# EAGLE board Inverter (EAGLE 9.6.2)
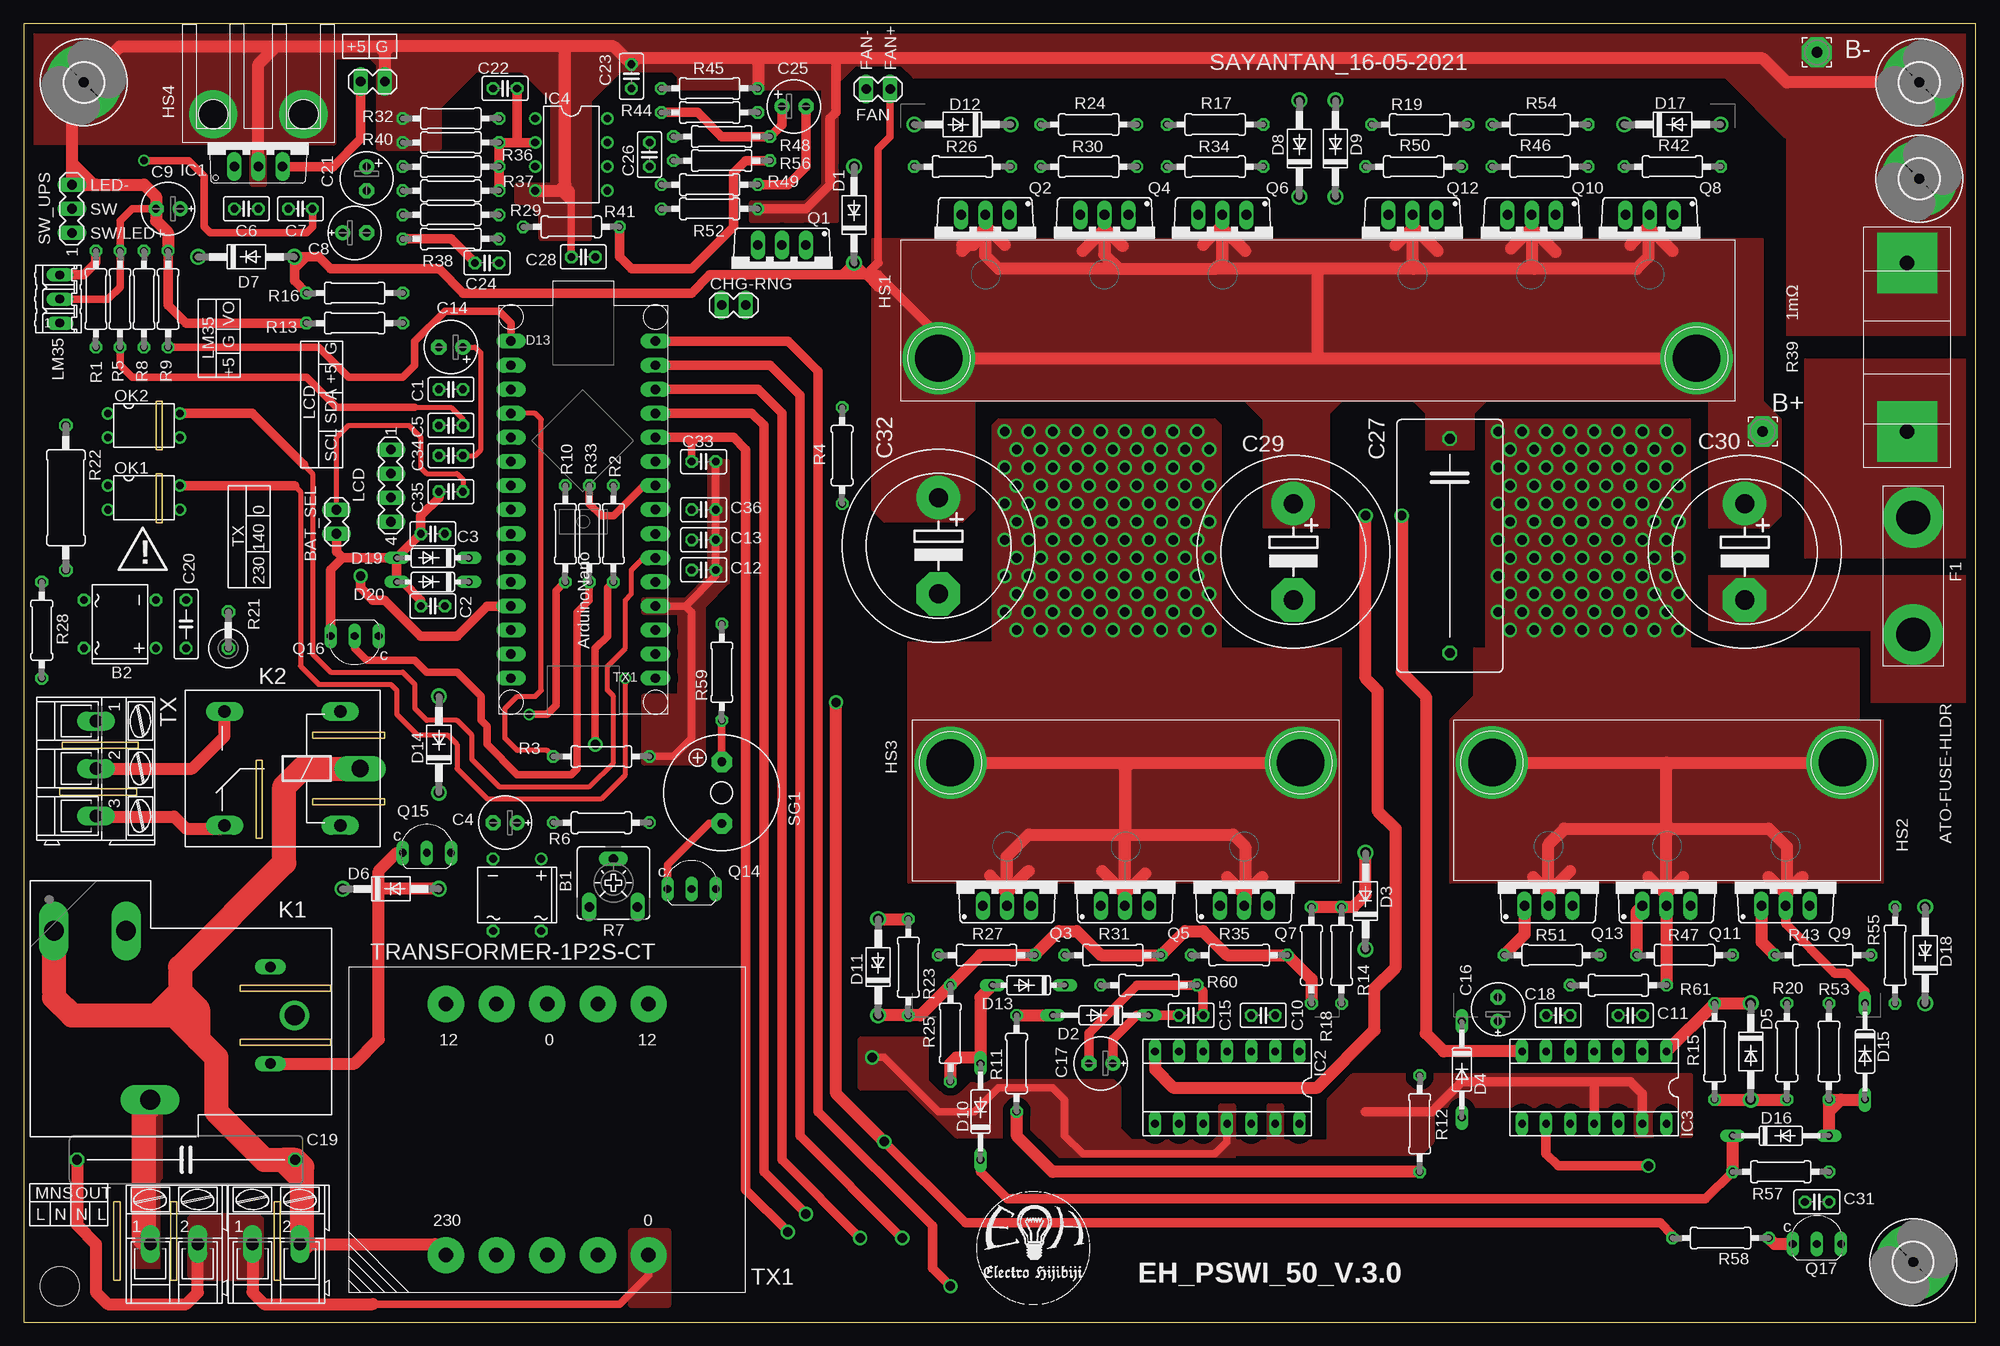
[diagram p1: board, top side]
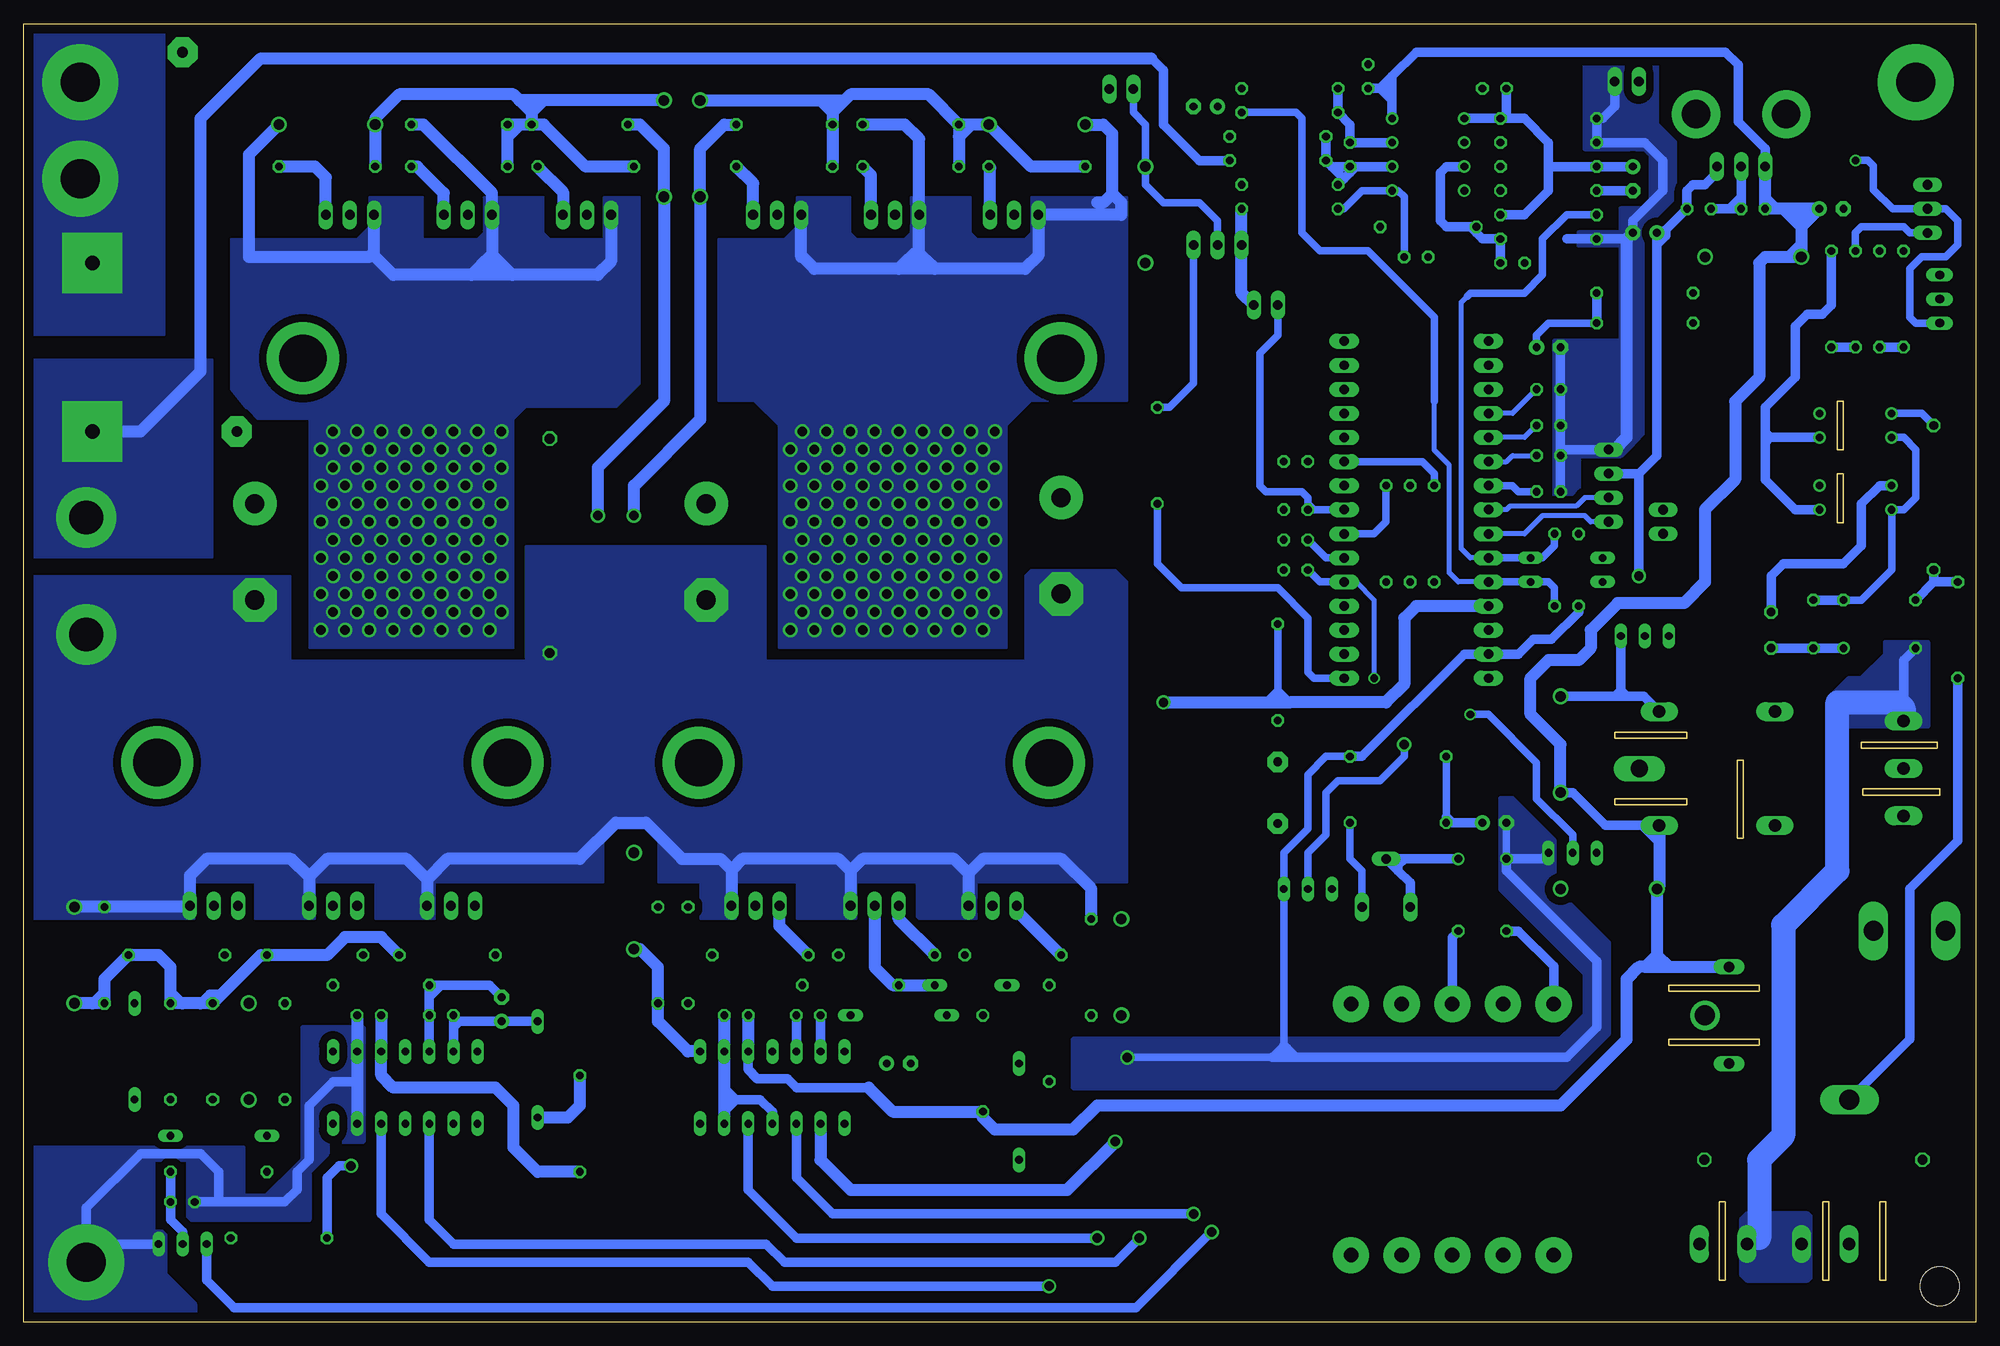
[diagram p2: board, bottom side, seen from below]

Size 206 x 137 mm. Coordinates in mm from the lower left corner, seen from the top.
Outline: 0,0 206,0 206,137 0,137 0,0
Outline: 14.61,97.16 14.61,92.08 13.97,92.08 13.97,97.16 14.61,97.16
Outline: 13.97,89.53 14.61,89.53 14.61,84.33 13.97,84.33 13.97,89.53
Outline: 9.53,12.7 9.53,4.45 10.16,4.45 10.16,12.7 9.53,12.7
Outline: 15.49,12.7 15.49,4.45 16.13,4.45 16.13,12.7 15.49,12.7
Outline: 26.42,12.7 26.42,4.45 27.05,4.45 27.05,12.7 26.42,12.7
Outline: 22.86,35.56 32.38,35.56 32.38,34.92 22.86,34.92 22.86,35.56
Outline: 22.86,29.84 32.38,29.84 32.38,29.21 22.86,29.21 22.86,29.84
Outline: 30.48,62.23 38.1,62.23 38.1,61.59 30.48,61.59 30.48,62.23
Outline: 30.48,55.24 38.1,55.24 38.1,54.61 30.48,54.61 30.48,55.24
Outline: 24.51,59.31 24.51,51.05 25.15,51.05 25.15,59.31 24.51,59.31
Outline: 4.06,61.21 12.06,61.21 12.06,60.58 4.06,60.58 4.06,61.21
Outline: 3.81,56.26 11.94,56.26 11.94,55.63 3.81,55.63 3.81,56.26
Copper layers (1*16): Top 0.035mm / dielectric 1.5mm / Bottom 0.035mm
Design rules "default *": minimum track width 20mil, minimum drill 0.8mm, track to track 20mil, track to pad 20mil, pad to pad 6mil, via to via 20mil, smd to smd 6mil, copper to edge 40mil, drill to drill 6mil, minimum pad ring 10mil, minimum via ring 8mil, stop-mask expansion 4mil, vias tented up to drill 0mil, thermal gap 10mil
Holes 4.11 mm at 3.81,3.81

## Footprints (pad centres in the part's own frame; a part is rotated, then mirrored left to right if it is on the bottom)
MA02-1 = drill 1.016 long: 1 -1.27,0; 2 1.27,0
ARDUINONANO-MINIMUM-TXT = drill 1 pad 1.575 long: 1 -7.62,16.51; 2 -7.62,13.97; 3 -7.62,11.43; 4 -7.62,8.89; 5 -7.62,6.35; 6 -7.62,3.81; 7 -7.62,1.27; 8 -7.62,-1.27; 9 -7.62,-3.81; 10 -7.62,-6.35; 11 -7.62,-8.89; 12 -7.62,-11.43; 13 -7.62,-13.97; 14 -7.62,-16.51; 15 -7.62,-19.05; 16 7.62,-19.05; 17 7.62,-16.51; 18 7.62,-13.97; 19 7.62,-11.43; 20 7.62,-8.89; 21 7.62,-6.35; 22 7.62,-3.81; 23 7.62,-1.27; 24 7.62,1.27; 25 7.62,3.81; 26 7.62,6.35; 27 7.62,8.89; 28 7.62,11.43; 29 7.62,13.97; 30 7.62,16.51
DB = drill 0.813: + -2.54,-3.81 | drill 0.813 octagon: - 2.54,-3.81; AC1 2.54,3.81; AC2 -2.54,3.81
3,17/1,1 = drill 1.118 pad 3.175 octagon: 1 0,0
C025-025X050 = drill 0.813 octagon: 1 -1.27,0; 2 1.27,0
E2,5-6E = drill 0.813 pad 1.575: + -1.27,0 | drill 0.813 pad 1.575 octagon: - 1.27,0
E2,5-6 = drill 0.813 pad 1.6: + -1.27,0 | drill 0.813 pad 1.6 octagon: - 1.27,0
C230-85X245 = drill 1.016 octagon: 1 -11.506,0; 2 11.506,0
C050-025X075 = drill 0.813 octagon: 1 -2.54,0; 2 2.54,0
C225-113X268 = drill 1.016 octagon: 1 -11.303,0; 2 11.303,0
EB20D = drill 2.007 pad 4.597: + -5.08,0 | drill 2.007 pad 4.597 octagon: - 5.08,0
DO41-10 = drill 1.118: A 5.08,0; C -5.08,0
DO35-10 = drill 0.813 long: A 5.08,0; C -5.08,0
DO41Z10 = drill 1.118: A 5.08,0; C -5.08,0
DO35-7 = drill 0.813 long: A 3.81,0; C -3.81,0
ATO-FUSE-HOLDER = drill 3.556 pad 6.35: P$1 -6.172,0; P$2 6.172,0
4,1-PAD = drill 4.1 pad 8: B4,1 0,0
MK-46-88MM = drill 5.004 pad 7.62: 1 -39.98,-3.988; 2 39.98,-3.988
MK-46-45MM = drill 5.004 pad 7.62: 1 -18.491,-3.988; 2 18.491,-3.988
PI49-20MM = drill 2.997 pad 5.08: 1 -4.75,2.997; 2 4.75,2.997
TO220V = drill 1.016 long: 1 -2.54,-2.54; 2 0,-2.54; 3 2.54,-2.54
SOCKET-14 = drill 0.813 long: 1 -7.62,-3.81; 2 -5.08,-3.81; 3 -2.54,-3.81; 4 0,-3.81; 5 2.54,-3.81; 6 5.08,-3.81; 7 7.62,-3.81; 8 7.62,3.81; 9 5.08,3.81; 10 2.54,3.81; 11 0,3.81; 12 -2.54,3.81; 13 -5.08,3.81; 14 -7.62,3.81
DIL08 = drill 0.813 pad 1.27: 1 -3.81,-3.81; 2 -1.27,-3.81; 3 1.27,-3.81; 4 3.81,-3.81; 5 3.81,3.81; 6 1.27,3.81; 7 -1.27,3.81; 8 -3.81,3.81
T90-C = drill 2.1 long: 1 -8.9,12.7; 5 8.9,15.24; 6 8.9,22.84 | drill 1.1 long: 2 -5.1,0; 4 5.1,0 | drill 2.1 pad 2.54: 3 0,-2.54
ZF112 = drill 1.321 long: 1 -6.096,5.994; 2 -6.096,-5.994; O 6.096,5.994; S 6.096,-5.994 | drill 1.803 long: P -8.204,0
MA04-1 = drill 1.016 long: 1 -3.81,0; 2 -1.27,0; 3 1.27,0; 4 3.81,0
03P = drill 0.914 long: 1 -2.54,0; 2 0,0; 3 2.54,0
AK300/2 = drill 1.321 long: 1 -2.515,0; 2 2.489,0
DIP4 = drill 0.8: 1 -1.27,-3.81; 2 1.27,-3.81; 3 1.27,3.81; 4 -1.27,3.81
TO220BV = drill 1.016 long: D 0,-2.54; G -2.54,-2.54; S 2.54,-2.54
TO92_LIN = drill 0.813 pad 1.143 long: 1 2.54,0; 2 0,0; 3 -2.54,0
0207/10 = drill 0.813 octagon: 1 -5.08,0; 2 5.08,0
CA6V = drill 1.016 long: A -2.54,-2.54; E 2.54,-2.54; S 0,2.54
0411V = drill 0.914 octagon: 1 -2.54,0; 2 1.27,0
0411/15 = drill 0.914 octagon: 1 -7.62,0; 2 7.62,0
SHUNT-R = drill 1.524 pad 6.35 square: P$1 -8.89,0; P$2 8.89,0
F/QMX = drill 0.914 pad 2.159 octagon: + 3.251,0; - -3.251,0
MA03-1 = drill 1.016 long: 1 -2.54,0; 2 0,0; 3 2.54,0
AK300/3 = drill 1.321 long: 1 -5.004,0; 2 0,0; 3 5.004,0
XFMR-1S2P-CT-41X34MM = drill 1.524 pad 3.81: 1 31.648,30.378; 2 26.302,30.378; 3 20.955,30.378; 4 15.608,30.378; 5 10.262,30.378; 6 10.262,3.886; 7 15.608,3.886; 8 20.955,3.886; 9 26.302,3.886; 10 31.648,3.886

## Placement (x,y rotation side)
5V  [MA02-1]  36.83,130.89 0 top
A1  [ARDUINONANO-MINIMUM-TXT]  59.05,84.45 180 top
B1  DBDB107G  [DB]  52.07,45.09 180 top
B2  DBDB107G  [DB]  10.16,73.66 90 top
B+  [3,17/1,1]  183.51,93.98 0 top
B-  [3,17/1,1]  189.23,133.99 0 top
BAT_SEL  [MA02-1]  33.02,84.45 270 top
C1  0.1u  [C025-025X050]  45.09,98.42 180 top
C2  0.1u  [C025-025X050]  43.18,75.56 180 top
C3  0.1u  [C025-025X050]  43.18,83.19 180 top
C4  10u  [E2,5-6E]  50.8,52.7 180 top
C5  0.1u  [C025-025X050]  45.09,94.61 180 top
C6  0.1u  [C025-025X050]  23.5,117.47 0 top
C7  0.1u  [C025-025X050]  29.21,117.47 180 top
C8  47u  [E2,5-6E]  34.92,114.94 0 top
C9  220u  [E2,5-6E]  15.24,117.47 180 top
C10  0.1u  [C025-025X050]  130.81,32.38 0 top
C11  0.1u  [C025-025X050]  169.54,32.38 0 top
C12  0.1u  [C025-025X050]  71.75,79.38 0 top
C13  0.1u  [C025-025X050]  71.75,82.55 0 top
C14  2.2u  [E2,5-6]  45.09,102.87 180 top
C15  0.1u  [C025-025X050]  123.19,32.38 0 top
C16  10u  [E2,5-6E]  155.57,33.02 90 top
C17  10u  [E2,5-6E]  113.67,27.3 180 top
C18  0.1u  [C025-025X050]  161.93,32.38 0 top
C19  2.2u  [C230-85X245]  17.14,17.14 180 top
C20  0.033u  [C050-025X075]  17.14,73.66 90 top
C21  4.7u  [E2,5-6]  36.2,120.65 270 top
C22  0.1u  [C025-025X050]  50.8,130.18 0 top
C23  0.1u  [C025-025X050]  64.14,131.44 90 top
C24  0.1u  [C025-025X050]  48.9,111.76 180 top
C25  0.47u  [E2,5-6]  81.28,128.27 0 top
C26  0.1u  [C025-025X050]  66.04,123.19 270 top
C27  1u  [C225-113X268]  150.5,81.92 270 top
C28  0.1u  [C025-025X050]  59.05,112.39 180 top
C29  4700u  [EB20D]  133.99,81.28 270 top
C30  4700u  [EB20D]  181.61,81.28 270 top
C31  0.01u  [C025-025X050]  189.23,12.7 180 top
C32  4700u  [EB20D]  96.52,81.92 270 top
C33  0.1u  [C025-025X050]  71.75,90.81 0 top
C34  0.1u  [C025-025X050]  45.09,91.44 180 top
C35  0.1u  [C025-025X050]  45.09,87.63 180 top
C36  0.1u  [C025-025X050]  71.75,85.72 0 top
CHG-RNG  [MA02-1]  74.93,107.31 0 top
D1  1N4004  [DO41-10]  87.63,116.84 90 top
D2  1N4148DO35-10  [DO35-10]  113.67,32.38 180 top
D3  MBR160  [DO41-10]  141.6,44.45 90 top
D4  1N4148DO35-10  [DO35-10]  151.76,26.67 270 top
D5  MBR160  [DO41-10]  182.25,28.57 270 top
D6  1N4004  [DO41-10]  38.73,45.72 0 top
D7  1N4004  [DO41-10]  23.5,112.39 0 top
D8  MBR160  [DO41-10]  134.62,123.83 90 top
D9  MBR160  [DO41-10]  138.43,123.83 90 top
D10  1N4148DO35-10  [DO35-10]  100.97,22.23 90 top
D11  1N4744A  [DO41Z10]  90.17,37.47 90 top
D12  1N4744A  [DO41Z10]  99.06,126.36 180 top
D13  1N4148DO35-7  [DO35-7]  106.05,35.56 180 top
D14  1N4004  [DO41-10]  43.81,60.96 90 top
D15  1N4148DO35-10  [DO35-10]  194.31,28.57 270 top
D16  1N4148DO35-10  [DO35-10]  185.42,19.68 0 top
D17  1N4744A  [DO41Z10]  173.99,126.36 0 top
D18  1N4744A  [DO41Z10]  200.66,38.73 90 top
D19  C5V1-7MM  [DO35-7]  43.18,80.64 180 top
D20  C5V1-7MM  [DO35-7]  43.18,78.11 180 top
F1  ATO-FUSE-HLDR  [ATO-FUSE-HOLDER]  199.39,78.74 270 top
FAN  [MA02-1]  90.17,130.1 180 top
H1  MOUNT-PAD-ROUND4.1  [4,1-PAD]  200.03,120.65 0 top
H2  MOUNT-PAD-ROUND4.1  [4,1-PAD]  6.35,130.81 0 top
H3  MOUNT-PAD-ROUND4.1  [4,1-PAD]  200.03,130.81 0 top
H4  MOUNT-PAD-ROUND4.1  [4,1-PAD]  199.39,6.35 0 top
HS1  MK-46-88MM  [MK-46-88MM]  136.55,105.69 0 top
HS2  MK-46-45MM  [MK-46-45MM]  173.43,55.07 180 top
HS3  MK-46-45MM  [MK-46-45MM]  116.28,55.04 180 top
HS4  HS-PI49  [PI49-20MM]  24.77,124.46 0 top
IC1  7805TV  [TO220V]  24.77,124.46 0 top
IC2  FAN9732  [SOCKET-14]  127,24.77 180 top
IC3  FAN9732  [SOCKET-14]  165.74,24.77 180 top
IC4  LM358N  [DIL08]  57.78,123.19 270 top
K1  HRG90-C  [T90-C]  26.04,32.38 90 top
K2  ZF112  [ZF112]  27.3,58.42 180 top
LCD  [MA04-1]  38.73,88.27 270 top
LM35  [03P]  3.81,107.95 90 top
MNS  [AK300/2]  15.88,8.26 0 top
OK1  SFH618A-2  [DIP4]  12.7,87 270 top
OK2  SFH618A-2  [DIP4]  12.7,94.61 270 top
OUT  [AK300/2]  26.67,8.26 0 top
Q1  Z44  [TO220BV]  80.01,111.12 180 top
Q2  Z44  [TO220BV]  101.47,114.3 180 top
Q3  Z44  [TO220BV]  103.76,46.48 0 top
Q4  Z44  [TO220BV]  114.05,114.3 180 top
Q5  Z44  [TO220BV]  116.2,46.48 0 top
Q6  Z44  [TO220BV]  126.49,114.3 180 top
Q7  Z44  [TO220BV]  128.78,46.48 0 top
Q8  Z44  [TO220BV]  171.58,114.3 180 top
Q9  Z44  [TO220BV]  185.93,46.48 0 top
Q10  Z44  [TO220BV]  159.13,114.3 180 top
Q11  Z44  [TO220BV]  173.35,46.48 0 top
Q12  Z44  [TO220BV]  146.56,114.3 180 top
Q13  Z44  [TO220BV]  160.91,46.48 0 top
Q14  BC547  [TO92_LIN]  70.48,45.72 0 top
Q15  BC547  [TO92_LIN]  42.55,49.53 0 top
Q16  BC547  [TO92_LIN]  34.92,72.39 180 top
Q17  BC547  [TO92_LIN]  189.23,8.26 0 top
R1  1k  [0207/10]  7.62,107.95 270 top
R2  1k  [0207/10]  62.23,83.19 270 top
R3  4.7k  [0207/10]  60.96,59.69 180 top
R4  560  [0207/10]  86.36,91.44 270 top
R5  10k  [0207/10]  10.16,107.95 90 top
R6  10k  [0207/10]  60.96,52.7 0 top
R7  5k  [CA6V]  62.23,46.35 0 top
R8  100  [0207/10]  12.7,107.95 90 top
R9  10k  [0207/10]  15.24,107.95 270 top
R10  560  [0207/10]  57.15,83.19 270 top
R11  10  [0207/10]  104.78,27.3 90 top
R12  10  [0207/10]  147.32,20.95 90 top
R13  22k  [0207/10]  34.92,105.41 0 top
R14  47  [0207/10]  139.06,38.73 90 top
R15  47  [0207/10]  178.44,28.57 270 top
R16  47k  [0207/10]  34.92,108.58 180 top
R17  47  [0207/10]  125.73,126.36 180 top
R18  10  [0207/10]  135.89,38.73 270 top
R19  47  [0207/10]  147.32,126.36 0 top
R20  10  [0207/10]  186.06,28.57 90 top
R21  100k  [0411V]  21.59,73.66 90 top
R22  100k  [0411/15]  4.45,87 270 top
R23  47k  [0207/10]  93.34,37.47 270 top
R24  47k  [0207/10]  112.39,126.36 180 top
R25  10k  [0207/10]  97.79,30.48 270 top
R26  4.7  [0207/10]  99.06,121.92 0 top
R27  4.7  [0207/10]  101.6,38.73 180 top
R28  220  [0207/10]  1.91,73.03 270 top
R29  1k  [0207/10]  45.09,116.84 0 top
R30  4.7  [0207/10]  112.39,121.92 0 top
R31  4.7  [0207/10]  114.94,38.73 180 top
R32  4.7k  [0207/10]  45.09,127 0 top
R33  560  [0207/10]  59.69,83.19 270 top
R34  4.7  [0207/10]  125.73,121.92 0 top
R35  4.7  [0207/10]  128.27,38.73 180 top
R36  120k  [0207/10]  45.09,121.92 0 top
R37  1k  [0207/10]  45.09,119.38 0 top
R38  120k  [0207/10]  45.09,114.3 0 top
R39  1mOhm  [SHUNT-R]  198.75,102.87 270 top
R40  2.2k  [0207/10]  45.09,124.46 0 top
R41  2.2k  [0207/10]  57.78,115.57 0 top
R42  4.7  [0207/10]  173.99,121.92 180 top
R43  4.7  [0207/10]  189.87,38.73 0 top
R44  1k  [0207/10]  72.39,127.64 180 top
R45  4.7k  [0207/10]  72.39,130.18 180 top
R46  4.7  [0207/10]  160.02,121.92 180 top
R47  4.7  [0207/10]  175.26,38.73 0 top
R48  220k  [0207/10]  73.66,125.09 180 top
R49  1k  [0207/10]  72.39,120.02 180 top
R50  4.7  [0207/10]  146.69,121.92 180 top
R51  4.7  [0207/10]  161.29,38.73 0 top
R52  2.2k  [0207/10]  72.39,117.47 180 top
R53  10k  [0207/10]  190.5,28.57 270 top
R54  47k  [0207/10]  160.02,126.36 180 top
R55  47k  [0207/10]  197.49,38.73 270 top
R56  2.2k  [0207/10]  73.66,122.56 0 top
R57  10k  [0207/10]  185.42,15.88 0 top
R58  4.7k  [0207/10]  179.07,8.89 180 top
R59  47  [0207/10]  73.66,68.58 90 top
R60  10  [0207/10]  118.75,35.56 180 top
R61  10  [0207/10]  168.28,35.56 180 top
SG1  F/QMX  [F/QMX]  73.66,55.88 90 top
SW_UPS  [MA03-1]  5.08,117.47 90 top
TX  [AK300/3]  7.62,58.42 270 top
TX1  TRANSFORMER-1P2S-CT  [XFMR-1S2P-CT-41X34MM]  76.2,37.47 180 top

## Tracks (layer width: path | path; a pad name or v marks a point on that pad's centre or on a via)
+5V  (via drill 0.8, 1, 1 pad 0.81)
  Top 0.813: C7.1 30.48,115.57 29.84,114.94 19.68,114.94 19.05,115.57 19.05,120.89 17.39,122.55 v12.69,122.55
  Top 1.016: IC3.9 160.66,17.78 161.93,16.51 v171.45,16.51 | R58.2 173.99,9.21 172.72,10.48 99.38,10.48 v90.81,19.05 | A1.27 48.9,75.56 45.72,72.39 41.91,72.39 38.1,76.2 36.83,76.2 35.56,77.47 v35.56,78.74 | IC1.3 32.64,121.92 35.56,124.84 5V.1
  Top 1.27: v90.81,19.05 85.72,24.13 v85.72,65.41
  Bottom 0.813: R59.2 73.66,66.67 | 73.66,66.67 73.66,65.41 | 73.66,66.67 74.93,65.41 | 73.66,66.67 72.39,65.41 | LM35.1 6.35,105.41 6.99,106.05 6.99,111.12 5.71,112.39 3.17,112.39 1.91,113.67 1.91,116.2 3.17,117.47 SW_UPS.2 8.78,117.47 10.81,119.5 10.81,122 11.39,122.58 12.66,122.58 v12.69,122.55
  Bottom 1.016: v171.45,16.51 172.72,16.51 173.99,15.24 R58.2 | IC1.3 27.3,121.28 28.57,120.02 29.84,120.02 30.48,119.38 C7.1 32.7,115.25 | 32.7,115.25 33.02,114.94 C8.+ 33.66,113.67 | 33.66,113.67 33.66,91.44 35.56,89.53 | 35.56,89.53 LCD.2 | 35.56,89.53 v35.56,78.74 | 32.7,115.25 32.7,114.62 33.66,113.67
  Bottom 1.27: IC2.9 121.92,17.14 118.75,13.97 95.89,13.97 v90.81,19.05 | v85.72,65.41 74.93,65.41 73.66,65.41 72.39,65.41 62.23,65.41 60.33,67.31 60.33,74.3 59.05,75.56 A1.27
+VE_CY
  Top 0.508: 29.53,90.49 30.48,89.53 30.48,70.48 32.38,68.58 40.01,68.58 41.27,67.31 41.27,64.77 42.55,63.5 45.72,63.5 47.31,61.91 47.31,59.37 50.16,56.52 59.69,56.52 62.23,59.05 62.23,66.04 61.59,66.67 61.59,69.22 63.5,71.12 63.5,76.2 64.14,76.83 64.14,79.38 65.41,80.64 A1.6
  Top 1.016: OK2.4 24.13,95.89 29.53,90.49
  Bottom 0.813: A1.6 68.58,80.64 C13.1
A4
  Bottom 0.508: LCD.3 41.27,87 42.16,86.11 49.15,86.11 49.53,85.72 A1.23
A5
  Bottom 0.508: LCD.4 40.64,84.45 41.27,85.09 45.72,85.09 47.62,83.19 A1.24
B+
  Top 0.813: FAN.1 91.44,125.09 90.17,123.83 90.17,111.76
  Top 1.016: 86.36,110.49 72.39,110.49 70.48,108.58 46.35,108.58 43.81,111.12 32.38,111.12 31.11,112.39 29.84,112.39 | 86.36,110.49 88.9,110.49 | 88.9,110.49 90.17,110.49 96.57,104.09 HS1.1 | 90.17,111.76 88.9,110.49 | 88.9,110.49 90.17,109.22 | 86.36,110.49 D1.C 88.9,110.49 | 29.84,112.39 D7.A 28.57,111.12 | 28.57,111.12 28.57,109.86 R16.2 | 28.57,111.12 29.84,112.39
  Top 1.27: Q4.D 114.05,112.65 115.57,111.12 | 115.57,111.12 125.73,111.12 | 125.73,111.12 126.49,111.89 Q6.D | 115.57,111.12 102.87,111.12 101.47,112.52 101.47,114.94 | Q12.D 146.56,111.63 146.69,111.12 | 146.69,111.12 136.53,111.12 | 136.53,111.12 125.73,111.12 | 159.38,111.12 159.13,111.38 Q10.D 159.13,115.44 | 159.38,111.12 146.69,111.12 | Q8.D 171.45,116.71 171.45,112.39 170.18,111.12 159.38,111.12 | 101.47,114.94 Q2.D | HS1.1 136.53,101.7 | 136.53,101.7 HS1.2 | 136.53,111.12 136.53,101.7 | 101.47,114.94 100.2,113.67 99.06,113.67 | Q2.D 101.47,115.7 103.5,113.67 | Q2.D 101.47,115.44 99.06,113.03 | Q4.D 114.05,115.32 111.76,113.03 | Q4.D 114.05,115.44 115.95,113.54 | Q6.D 126.49,115.7 124.46,113.67 | Q6.D 126.49,115.44 128.91,113.03 | Q12.D 146.56,115.44 144.78,113.67 | Q12.D 146.56,115.7 149.22,113.03 | 159.13,115.44 156.97,113.28 | 159.13,115.44 161.67,112.9 | Q8.D 171.58,115.7 169.54,113.67 | Q8.D 171.58,115.44 173.99,113.03
  pour Top (isolate 0.813, no thermals): 89.53,114.3 183.51,114.3 183.51,97.16 89.53,97.16
  pour Top (isolate 0.813, no thermals): 89.53,97.16 89.53,85.72 90.81,84.45 99.06,84.45 100.33,85.72 100.33,97.16
  pour Top (isolate 0.813, no thermals): 128.91,97.16 130.81,95.25 130.81,83.82 137.79,83.82 137.79,95.89 139.06,97.16
  pour Top (isolate 0.813, no thermals): 146.69,97.16 147.96,95.89 147.96,92.08 153.03,92.08 153.03,95.89 154.31,97.16
  pour Top (isolate 0.813, no thermals): 177.8,97.16 183.51,97.16 185.42,95.25 185.42,85.09 184.15,83.82 177.8,83.82
BAT_SENS
  Top 0.508: C34.1 47.62,91.44 48.26,92.08 48.26,102.23 47.62,102.87 C14.+
  Bottom 0.508: A1.21 49.53,90.81 48.9,91.44 C34.1
  Bottom 0.813: R13.2 45.09,105.41 46.04,104.46 46.35,104.14 C14.+
  Bottom 1.016: R16.1 R13.2
BUZZ
  Bottom 0.813: A1.7 63.5,83.19 62.23,84.45 R2.1
CHG-RLY
  Top 0.813: A1.9 65.41,88.27 62.23,85.09 60.96,85.09 59.69,86.36 R33.1
CHG-RNG
  Bottom 0.813: 70.48,86.36 C36.1 69.85,85.72 | 70.48,86.36 70.48,87 71.12,87.63 74.93,87.63 75.56,88.27 75.56,102.23 73.66,104.14 CHG-RNG.1 | A1.8 69.85,85.72 | 69.85,85.72 70.48,86.36
CHNG-OVR-RLY
  Bottom 0.813: A1.10 60.96,90.81 58.42,90.81 57.15,89.53 R10.1
FAN
  Bottom 0.813: A1.1 69.85,67.94 70.48,68.58 70.48,74.3 73.66,77.47 83.82,77.47 86.36,80.01 R4.2
FUSE_BLOWN  (via drill 1)
  Top 0.813: C33.1 70.48,92.71 | 70.48,92.71 70.48,93.34 | 70.48,92.71 69.85,93.34 | 70.48,92.71 71.12,93.34 71.75,93.34
  Top 1.016: v80.64,9.53 76.2,13.97 76.2,92.08 74.93,93.34 71.75,93.34 70.48,93.34 69.85,93.34 A1.11
  Top 1.27: Q17.3 184.78,8.26 R58.1
  Bottom 1.016: Q17.3 186.69,4.45 183.77,1.52 88.65,1.52 v80.64,9.53
GND  (via drill 1)
  Top 0.813: 57.15,118.75 56.52,119.38 | C28.2 57.78,118.11 | 57.15,118.75 57.15,120.02 57.78,119.38 57.78,118.11 | 57.15,118.75 57.78,118.11 | 69.85,75.56 70.48,74.93 70.48,61.59 68.58,59.69 R3.1 | 69.85,75.56 A1.4 | 69.85,75.56 73.03,78.74 C12.2 C13.2 C36.2 C33.2 | LM35.2 8.89,107.95 10.16,109.22 R5.2 10.16,116.2 11.43,117.47 C9.- | IC2.11 127,19.05 125.73,17.78 111.76,17.78 109.86,19.68 109.86,23.5 108.58,24.77 102.87,24.77 100.33,22.23 96.52,22.23 90.81,27.94 v89.53,27.94
  Top 1.016: 141.6,22.23 148.59,22.23 151.76,25.4 165.74,25.4 | IC3.13 170.81,24.13 169.54,25.4 165.74,25.4 | R38.1 45.09,114.3 C24.2 | 33.66,80.64 32.38,79.38 Q16.1 | 33.66,80.64 D19.A | D19.A C3.2 41.91,85.09 43.81,87 C35.2 | D19.A D20.A 40.01,78.11 41.91,76.2 C2.2 | R52.1 82.55,117.47 85.09,120.02 85.09,127 85.72,127.64 85.72,133.35 | BAT_SEL.2 33.02,81.28 33.66,80.64 | IC3.11 165.74,25.4 | R9.1 15.24,107.31 17.14,105.41 R13.1 | 5.08,121.28 6.35,120.02 | 5.08,122.56 7.62,120.02
  Top 1.27: H3.B4,1 186.06,130.81 183.51,133.35 85.72,133.35 77.47,133.35 | 77.47,133.35 64.77,133.35 | 64.77,133.35 C23.2 63.5,133.35 | 63.5,133.35 62.23,134.62 57.15,134.62 | 38.73,134.62 38.1,133.99 | 38.1,133.99 5V.2 | 57.15,134.62 38.73,134.62 | IC1.2 24.77,132.72 26.67,134.62 | 37.47,134.62 38.1,133.99 | 26.67,134.62 37.47,134.62 | 38.73,134.62 37.47,134.62 | IC4.4 56.52,119.38 57.15,120.02 57.15,134.62 | 64.77,133.35 63.5,133.35 | 77.47,133.35 R45.1 | 26.67,134.62 10.16,134.62 H2.B4,1 5.08,129.54 5.08,122.56 5.08,121.28 SW_UPS.3 6.35,120.02 7.62,120.02 12.7,120.02 13.97,118.75 C9.- 13.97,116.2 15.24,114.94 R9.1
  Bottom 0.813: 22.23,96.52 22.23,93.98 | 22.23,93.98 21.59,93.34 22.23,92.71 | 21.59,88.27 22.23,88.9 | 22.23,89.53 22.23,92.71 | 22.23,93.98 22.23,92.71 | B1.- C4.- | R3.1 68.58,59.69 70.48,57.78 70.48,52.07 73.03,49.53 Q14.1 73.03,29.21 74.3,27.94 v89.53,27.94
  Bottom 1.016: 170.81,25.4 173.35,25.4 175.9,22.86 175.9,17.14 177.16,15.88 177.16,13.97 178.44,12.7 185.42,12.7 | 185.42,12.7 C31.2 | 185.42,12.7 185.42,15.88 187.32,17.78 193.68,17.78 199.39,12.06 199.39,8.26 | 199.39,8.26 H4.B4,1 | Q17.1 199.39,8.26 | IC2.11 127,22.23 128.27,23.5 130.81,23.5 | 130.81,23.5 132.08,23.5 | 130.81,23.5 132.08,24.77 | 130.81,23.5 132.08,22.23 | 43.18,114.3 R38.1 36.83,114.3 | C7.2 26.04,117.47 | 26.04,117.47 C6.2 24.77,118.75 | 24.77,118.75 IC1.2 | 5V.2 38.1,128.27 39.37,127 R32.1 R40.1 34.92,124.46 33.02,122.56 33.02,119.38 36.2,116.2 C8.- | C35.2 C34.2 43.81,92.08 | 43.81,92.08 C5.2 C1.2 C14.- | LCD.1 43.81,92.08 | 71.75,27.94 72.71,28.89 | 72.71,28.89 73.03,29.21 | 71.75,27.94 43.18,27.94 40.01,31.11 40.01,38.1 49.53,47.62 B1.- 45.72,48.9 Q15.1 | 71.75,27.94 73.03,27.94 | 73.03,27.94 74.3,27.94 | 72.71,28.89 72.71,28.26 73.03,27.94 | R3.1 64.77,59.69 53.98,70.48 A1.29 48.26,70.48 46.67,72.07 44.77,72.07 41.91,74.93 C2.2 | R9.1 15.24,107.31 16.19,106.36 17.78,106.36 19.05,105.09 19.05,99.69 22.23,96.52 22.23,89.53 22.23,88.9 19.05,85.72 OK1.3 | OK2.3 21.59,93.34 | 24.77,118.75 26.04,117.47
  Bottom 1.27: C10.2 IC2.2 132.08,24.77 132.08,23.5 132.08,22.23 IC2.13 | IC3.13 170.81,25.4 IC3.2 C11.2 | CHG-RNG.2 77.47,108.58 Q1.S R52.1 | LCD.1 38.1,92.08 36.83,93.34 36.83,114.3 C8.-
  pour Bottom (isolate 0.813, no thermals): 191.13,104.14 206.38,104.14 206.38,137.16 191.13,137.16
  pour Top (isolate 0.813, no thermals): 186.06,104.14 206.38,104.14 206.38,137.16 186.06,137.16
  pour Top (isolate 0.813, no thermals): 186.06,125.09 179.71,131.44 158.12,131.44 93.98,131.44 92.71,132.72 87.63,132.72 86.36,131.44 85.72,130.81 85.72,116.2 76.83,116.2 76.83,118.11 82.55,118.11 84.45,120.02 84.45,137.16 192.41,137.16 192.41,125.09
  pour Top (isolate 0.813, no thermals): 84.45,130.18 69.22,130.18 69.22,131.44 68.58,132.08 62.87,132.08 59.69,128.91 59.69,114.3 54.61,114.3 54.61,116.84 53.34,118.11 52.07,118.11 52.07,120.02 55.88,120.02 55.88,128.91 52.7,132.08 47.62,132.08 43.81,128.27 43.81,123.83 37.47,123.83 37.47,132.72 36.7,133.48 27.03,133.48 25.4,131.85 25.4,120.02 24.13,120.02 24.13,124.46 0,124.46 0,137.16 84.45,137.16
  pour Top (isolate 0.813): 126.36,21.59 126.36,19.68 125.73,19.05 116.84,19.05 116.2,19.68 115.57,20.32 115.57,24.77 114.94,25.4 100.33,25.4 99.06,24.13 96.52,24.13 95.25,25.4 95.25,29.84 88.27,29.84 88.27,24.77 93.34,24.77 98.42,19.68 107.31,19.68 109.86,17.14 127.64,17.14 127.64,21.59
  pour Top (isolate 0.813, no thermals): 170.18,19.68 170.18,22.86 149.22,22.86 148.59,22.23 148.59,19.05 147.32,17.78 127.64,17.78 126.36,17.78 126.36,22.86 127.64,22.86 127.64,19.05 131.44,19.05 131.44,22.86 132.72,22.86 132.72,19.05 137.79,19.05 137.79,23.5 139.06,24.77 140.34,26.04 160.66,26.04 175.9,26.04 175.9,19.68
  pour Bottom (isolate 0.813, no thermals): 191.13,8.89 191.13,5.08 187.96,1.91 187.96,0 206.38,0 206.38,16.51 206.38,18.41 182.88,18.41 182.88,13.34 180.34,13.34 177.16,16.51 176.53,17.14 176.53,23.5 176.53,31.11 170.18,31.11 170.18,19.05 173.99,19.05 173.99,17.78 175.9,15.88 175.9,10.79 188.59,10.79 188.59,17.14 191.77,17.14 192.41,17.14 192.41,9.53 191.13,9.53
  pour Bottom (isolate 0.813, no thermals): 44.45,49.53 44.45,50.8 48.9,55.24 50.16,55.24 50.16,45.72 49.53,45.09 41.27,36.83 41.27,33.02 41.27,32.38 42.55,31.11 43.81,29.84 95.25,29.84 95.25,24.77 44.45,24.77 41.27,27.94 38.73,30.48 38.73,40.01 44.45,45.72
  pour Bottom (isolate 0.813, no thermals): 37.47,132.72 40.01,132.72 41.27,132.72 41.27,123.83 34.92,123.83 34.29,123.19 34.29,118.11 34.92,117.47 37.47,117.47 37.47,114.94 41.91,114.94 41.91,113.67 37.47,113.67 37.47,103.5 44.45,103.5 44.45,87 41.91,87 41.91,91.44 37.47,91.44 36.2,92.71 34.92,93.98 34.92,115.57 31.75,118.75 31.75,122.56 31.75,124.46 33.66,126.36 33.66,132.72
  pour Top (isolate 0.813, no thermals): 72.39,90.81 72.39,78.74 69.85,76.2 65.41,76.2 65.41,74.93 69.22,74.93 69.22,66.04 65.41,66.04 65.41,59.05 71.75,59.05 71.75,75.56 74.3,78.11 74.3,90.81
  pour Top (isolate 0.813, no thermals): 25.65,124.46 32.77,124.46 32.77,133.35 25.65,133.35
HS1  (via drill 1)
  Top 1.016: v82.55,11.43 78.11,15.88 78.11,94.61 76.83,95.89 A1.12
  Bottom 1.016: IC2.10 124.46,15.24 120.65,11.43 v82.55,11.43
HS2  (via drill 1)
  Top 1.016: v88.27,8.89 80.01,17.14 80.01,95.89 77.47,98.42 A1.13
  Bottom 1.016: IC3.10 163.19,10.79 160.66,8.26 127.64,8.26 125.73,6.35 90.81,6.35 v88.27,8.89
I_CHG_SENS
  Bottom 0.508: A1.26 54.61,78.11 55.56,79.06 55.56,90.44 57.15,92.02 57.15,97.16
  Bottom 0.813: R44.1 71.75,127.64 71.12,127 71.12,114.94 69.22,113.03 64.14,113.03 57.15,106.05 57.15,97.16 | C2.1 44.45,77.47 45.09,78.11 D20.C A1.26
LOAD_SENS
  Bottom 0.508: A1.25 53.34,80.64 54.29,81.6 54.29,107.63 53.66,108.27
  Bottom 0.813: R29.1 43.18,116.84 45.72,114.3 45.72,110.49 47.62,108.58 53.34,108.58 53.66,108.27 | C3.1 44.45,81.92 45.72,80.64 D19.C A1.25
LS1  (via drill 1)
  Top 1.016: v92.71,8.89 81.92,19.68 81.92,97.79 78.74,100.97 A1.14
  Bottom 1.016: IC2.12 129.54,13.97 124.46,8.89 v92.71,8.89
LS2  (via drill 1)
  Top 1.016: v97.79,3.81 95.89,5.71 95.89,10.16 83.82,22.23 83.82,100.33 80.64,103.5 A1.15
  Bottom 1.016: IC3.12 168.28,11.43 163.19,6.35 129.54,6.35 127,3.81 v97.79,3.81
MNS-L
  Top 1.27: 13.34,22.86 K1.1 | MNS.1 12.7,8.91
  Top 2.54: 13.34,22.86 13.36,22.84 12.7,22.17 12.7,8.91
  Bottom 1.016: K1.1 6.99,29.84 6.99,45.72 1.91,50.8 R28.2
  pour Top (isolate 0.813, no thermals): 11.43,22.23 14.61,22.23 14.61,15.24 14.35,14.99 14.35,5.71 11.43,5.71
MNS_SENS  (via drill 0.8)
  Top 0.508: 28.57,88.27 29.21,87.63 29.21,69.22 31.11,67.31 38.73,67.31 39.37,66.67 39.37,64.14 41.59,61.91 44.77,61.91 45.72,60.96 45.72,58.42 48.9,55.24 60.96,55.24 63.5,57.78 v63.5,67.94
  Top 1.016: OK1.4 28.57,88.27
  Bottom 0.508: A1.5 65.41,78.11 63.5,76.2 v63.5,67.94
  Bottom 0.813: A1.5 69.22,78.11 C12.1
MODE
  Top 0.508: C35.1 46.35,88.9 45.72,89.53 42.55,89.53 41.91,90.17 41.91,93.34 40.64,94.61 34.29,94.61 33.02,93.34 BAT_SEL.1
  Bottom 0.813: A1.22 48.9,88.27 48.26,87.63 C35.1
N$1
  Bottom 1.27: R12.2 147.32,22.86 148.59,21.59 D4.A
N$2  (via drill 0.8)
  Top 0.813: v53.34,64.14 55.24,64.14 56.2,65.09 56.2,77.15 R10.2
  Bottom 0.813: Q15.2 42.55,51.44 46.35,55.24 46.35,59.05 51.44,64.14 v53.34,64.14
N$3
  Top 1.016: C17.+ 114.94,29.84 117.47,32.38 D2.C C15.1
  Bottom 1.016: C15.1 IC2.6
N$4
  Bottom 1.016: IC3.6 160.66,31.11 | 160.66,31.11 160.66,31.75 | 160.66,31.75 C18.1 | D4.C C16.+ 159.38,31.75 160.02,31.75 | 160.02,31.75 160.66,31.75 | 160.66,31.11 160.02,31.75
N$5
  Top 0.813: Q14.3 67.94,48.26 72.31,52.63 SG1.-
N$6
  Bottom 1.27: D8.A 121.92,128.91 | 121.92,128.91 120.65,127.64 | 120.65,127.64 R17.2 R34.1 | 106.05,126.36 D12.C 99.69,121.92 R26.1 | 106.05,126.36 R24.2 | R24.2 107.31,125.09 | 107.31,125.09 R30.1 | R24.2 110.49,129.54 118.75,129.54 119.38,128.91 | 119.38,128.91 120.65,127.64 | 121.92,128.91 119.38,128.91 | 106.05,126.36 107.31,125.09
N$7
  Top 1.27: R11.2 D2.A
N$8  (via drill 1)
  Top 1.27: IC2.7 119.38,26.67 121.28,24.77 136.53,24.77 142.56,30.8 142.56,35.24 144.78,37.47 144.78,52.07 142.88,53.98 142.88,66.67 141.6,67.94 v141.6,85.09
  Bottom 1.27: R17.1 132.08,126.36 134.62,123.83 D8.C 134.62,95.25 141.6,88.27 v141.6,85.09
N$9
  Bottom 1.27: IC2.1 135.89,28.57 139.06,31.75 R14.1 139.06,37.47 140.97,39.37 D3.C
N$10  (via drill 1)
  Top 1.27: IC3.7 149.86,28.57 147.96,30.48 147.96,66.04 145.41,68.58 v145.41,85.09
  Bottom 1.27: R19.1 140.97,126.36 138.43,123.83 D9.C 138.43,97.16 145.41,90.17 v145.41,85.09
N$11
  Top 1.27: IC3.1 R15.1 D5.C
N$12
  Top 1.27: D11.C R23.2 94.61,32.38 R25.1 100.97,38.73 R27.1 109.22,41.27 111.12,41.27 113.67,38.73 R31.1 122.56,41.27 124.46,41.27 127,38.73 R35.1 135.89,36.2 R18.2
N$13
  Top 1.27: 188.59,43.81 Q9.S | D11.A R23.1
  Bottom 1.27: 106.3,47.37 104.78,48.9 96.52,48.9 93.34,45.72 R23.1 | 106.3,47.37 Q3.S | 106.3,47.37 107.82,48.9 117.47,48.9 118.75,47.62 | 118.75,47.62 Q5.S | 118.75,47.62 120.02,48.9 130.18,48.9 131.32,47.75 | 131.32,47.75 Q7.S | 131.32,47.75 132.46,48.9 136.53,48.9 140.34,52.7 143.51,52.7 147.32,48.9 161.29,48.9 163.45,46.74 | 163.45,46.74 Q13.S | 163.45,46.74 165.61,48.9 173.99,48.9 175.9,46.99 | 175.9,46.99 Q11.S | 175.9,46.99 177.8,48.9 186.69,48.9 188.47,47.12 Q9.S 188.59,43.81 R55.1 D18.A
  pour Bottom (isolate 0.813, no thermals): 89.53,46.35 105.41,46.35 105.41,42.55 111.76,42.55 111.76,46.35 118.11,46.35 118.11,42.55 124.46,42.55 124.46,46.35 130.81,46.35 130.81,42.55 134.62,42.55 134.62,46.35 139.06,46.35 139.06,50.8 140.34,52.07 143.51,52.07 144.78,50.8 144.78,46.35 162.56,46.35 162.56,42.55 168.91,42.55 168.91,46.35 175.26,46.35 175.26,42.55 181.61,42.55 181.61,46.35 187.96,46.35 187.96,42.55 205.74,42.55 205.74,69.85 89.53,69.85
  pour Bottom (isolate 0.813, no thermals): 149.22,63.5 149.22,65.41 151.13,67.31 153.03,67.31 153.03,81.92 127.64,81.92 127.64,63.5
  pour Bottom (isolate 0.813, no thermals): 90.81,79.38 99.69,79.38 100.33,78.74 100.33,63.5 89.53,63.5 89.53,78.11
  pour Bottom (isolate 0.813, no thermals): 177.8,78.74 205.74,78.74 205.74,63.5 177.8,63.5
  pour Top (isolate 0.813, no thermals): 177.8,73.03 194.94,73.03 194.94,65.41 206.38,65.41 206.38,78.74 177.8,78.74
N$14
  Bottom 1.27: 151.13,128.91 152.4,127.64 | 152.4,127.64 R19.2 | D9.A 151.13,128.91 | R50.2 146.69,121.92 151.13,126.36 R19.2 | R19.2 153.67,126.36 | 153.67,126.36 R54.2 154.94,125.09 | R46.2 154.94,125.09 | 152.4,127.64 153.67,128.91 | 153.67,128.91 154.31,129.54 166.37,129.54 168.91,127 D17.C R42.2 | 151.13,128.91 153.67,128.91 | 154.94,125.09 153.67,126.36
N$15
  Bottom 1.016: 189.23,33.66 190.5,34.92 | 185.1,34.61 186.37,34.61 187.32,33.66 | 197.49,34.92 198.75,33.66
  Bottom 1.27: R51.2 168.28,40.64 172.09,40.64 173.99,38.73 R47.2 180.97,38.73 185.1,34.61 R20.2 187.32,33.66 189.23,33.66 R53.1 190.5,34.92 190.5,37.47 191.77,38.73 R43.2 197.49,36.2 197.49,34.92 R55.2 198.75,33.66 D18.C
N$16
  Bottom 1.27: Q2.G 104.01,121.79 R26.2
N$17
  Bottom 1.016: IC4.3 55.88,121.92 56.52,121.28 56.52,116.2 55.88,115.57 53.34,115.57 | 53.34,115.57 R41.1 52.7,114.94 | 52.7,114.94 52.07,114.3 R38.2 C24.1 | 53.34,115.57 52.7,114.94
N$18
  Bottom 1.016: TX1.10 44.55,37.57 48.26,41.27 B1.AC1
N$19
  Bottom 1.016: IC3.5 C18.2 163.19,34.29 | 163.19,34.29 R61.2 161.93,35.56 | C16.- 156.84,35.56 161.93,35.56 | 163.19,34.29 161.93,35.56
N$20
  Top 1.016: LM35.3 6.35,110.49 7.62,111.76 R1.1
N$21
  Bottom 1.016: B1.AC2 55.24,40.64 TX1.8
N$22
  Top 1.016: 52.07,124.46 IC4.2 | C22.2 52.07,124.46 | 52.07,124.46 R40.2 R36.2 R37.2
N$23
  Bottom 1.016: B1.+ 60.33,48.9 | 60.33,48.9 R7.S 60.96,47.62 | R7.A 59.69,46.35 60.96,47.62 | 60.33,48.9 60.96,48.26 60.96,47.62
N$24  (via drill 1)
  Top 0.813: R2.2 61.59,77.47 61.59,72.39 60.33,71.12 v60.33,60.96
  Bottom 0.813: Q14.2 70.48,49.53 68.58,51.44 68.58,55.88 67.31,57.15 62.87,57.15 60.33,59.69 v60.33,60.96
N$25
  Bottom 0.813: R7.E 64.77,47.62 66.04,48.9 R6.2
N$26
  Bottom 1.27: R27.2 101.22,43.43 Q3.G
N$27
  Top 1.016: C17.- 112.39,30.48 117.47,35.56 R60.1 124.46,34.92 C15.2
  Bottom 1.016: C15.2 IC2.5
N$28
  Bottom 0.813: Q1.G 82.55,99.06 85.09,96.52 R4.1
N$29
  Bottom 1.016: R28.1 4.45,78.11 | 4.45,78.11 B2.AC1 | R22.2 4.45,78.11
N$30
  Bottom 0.813: FAN.2 88.9,127.64 87.63,126.36 D1.A 87.63,120.02 85.72,118.11 81.92,118.11 80.01,116.2 Q1.D
N$31
  Top 1.27: K1.2 34.91,27.29 37.47,29.84 37.47,45.72 | Q15.3 39.37,49.53 37.47,47.62 37.47,45.72 | D6.A 37.47,45.72
N$32
  Top 1.27: Q13.G 158.37,40.89 R51.1
N$33
  Bottom 1.016: K2.2 35.03,66.04 36.83,66.04 | 36.83,66.04 37.47,66.04 | 37.47,66.04 38.1,66.04 | 38.1,66.04 D14.A | Q16.3 37.47,66.67 | 37.47,66.67 37.47,66.04 | 37.47,66.67 36.83,66.04 | 37.47,66.67 38.1,66.04
N$34
  Top 0.813: Q16.2 34.92,71.12 36.2,69.85 41.27,69.85 42.55,68.58 45.72,68.58 48.26,66.04 48.26,63.5 48.9,62.87 48.9,60.96 52.07,57.78 57.78,57.78 58.42,58.42 58.42,74.93 59.69,76.2 R33.2
N$35
  Bottom 1.27: R50.1 149.1,119.25 Q12.G
N$36
  Bottom 1.016: OK1.1 10.16,88.27 12.06,86.36 12.06,81.92 13.97,80.01 20.32,80.01 21.59,78.74 R21.2
N$37
  Bottom 0.813: R22.1 5.71,95.89 OK2.1
N$38
  Bottom 0.813: B2.- 12.06,76.2 8.89,79.38 OK1.2 7.62,85.72 6.35,87 6.35,92.08 7.62,93.34 OK2.2
  Bottom 1.016: B2.- C20.2
N$39
  Bottom 1.016: B2.+ C20.1 R21.1
N$40
  Bottom 1.016: C21.+ R36.1 45.09,121.92 | 45.09,121.92 45.09,124.46 47.62,127 49.53,127 | 49.53,127 R32.2 IC4.1 | R29.2 47.62,116.84 45.09,119.38 45.09,121.92 | C22.1 49.53,127
N$41
  Bottom 1.016: C21.- R37.1
N$42
  Top 1.27: Q9.G 183.39,40.13 R43.1
N$43
  Top 1.27: 100.97,27.94 100.97,34.29 D13.A | 100.97,27.94 D10.A | R25.2 97.79,27.3 98.42,27.94 100.97,27.94
N$44
  Bottom 1.27: Q4.G 116.59,121.03 R30.2
N$45
  Bottom 1.27: Q6.G 129.03,120.14 R34.2
N$46
  Bottom 1.27: Q8.G 174.12,120.78 175.26,121.92 R42.1
N$47
  Bottom 1.27: Q10.G 161.67,119.13 164.47,121.92 R46.1
N$48
  Top 1.27: Q11.G 170.18,43.31 R47.1
N$49
  Bottom 1.27: R31.2 113.67,42.55 Q5.G
N$50
  Top 1.016: D10.C 100.97,15.88 103.82,13.02 177.48,13.02 R57.1
  Top 1.27: R57.1 D16.C
N$51
  Bottom 1.27: R35.2 126.24,41.78 Q7.G
N$52
  Top 1.27: 191.77,23.5 R53.2 190.5,22.23 | 191.77,23.5 D15.A | 190.5,22.23 D16.A | 190.5,22.23 191.77,23.5
N$53
  Top 1.27: R15.2 D5.A R20.1
N$54
  Top 1.27: R18.1 R14.2 140.34,43.81 141.6,45.09 D3.A
N$55
  Bottom 1.016: Q17.2 189.23,9.53 190.5,10.79 C31.1 R57.2
N$56
  Bottom 0.813: SW_UPS.1 6.99,114.94 7.62,115.57 12.06,115.57 12.7,114.94 R8.2
N$57
  Bottom 1.016: C26.2 65.41,121.92 | 65.41,121.92 IC4.6 | C26.2 66.04,121.28 | 66.04,121.28 66.67,120.65 | 66.67,120.65 R49.2 | R48.2 R56.1 67.94,121.92 | 67.94,121.92 C26.2 | 66.67,120.65 67.94,121.92 | 66.04,121.28 65.41,121.92
N$58
  Top 1.016: C25.+ 80.01,126.36 R48.1 73.66,125.09 71.12,127.64 R44.2
  Bottom 1.016: R45.2 R44.2 66.04,126.36 C26.1 IC4.7
N$59
  Bottom 0.813: R52.2 66.67,117.47 64.77,119.38 IC4.5 60.96,119.38 60.33,118.75 C28.1
N$60
  Top 1.016: R49.1 80.64,120.02 82.55,121.92 C25.-
N$61
  Top 0.813: SG1.+ R59.1
NEU
  Top 0.813: 36.83,1.91 62.87,1.91 65.94,4.98 TX1.5
  Top 1.27: C19.2 5.64,10.24 7.62,8.26 7.62,3.17 8.89,1.91 17.14,1.91 18.36,3.12 MNS.2 | OUT.1 24.16,3.2 24.13,3.17 25.4,1.91 36.83,1.91
  Bottom 1.016: B2.AC2 7.62,69.85 7.62,64.14 TX.1
  Bottom 2.54: 7.62,64.14 7.62,64.77 8.26,65.41 14.61,65.41 14.61,47.62 20.32,41.91 20.32,19.68 22.86,17.14 22.86,8.89
  pour Top (isolate 0.813, no thermals): 17.14,10.79 17.14,5.08 17.78,4.45 24.77,4.45 25.4,5.08 25.4,10.79 24.77,11.43 17.78,11.43
  pour Top (no thermals): 64.14,9.53 64.14,1.91 67.94,1.91 67.94,9.53
  pour Bottom (no thermals): 6.35,62.87 15.24,62.87 15.24,66.04 14.61,66.67 13.34,67.94 12.06,67.94 9.53,70.48 9.53,71.75 5.08,71.75 5.08,62.87
  pour Bottom (isolate 0.813, no thermals): 17.78,11.43 24.13,11.43 24.77,10.79 24.77,5.08 24.13,4.45 17.78,4.45 17.14,5.08 17.14,10.79
OUT-L
  Top 1.27: OUT.2 29.41,8.26 43.38,8.26 TX1.1 | 3.19,34.92 3.19,34.29
  Top 2.54: K1.6 3.19,34.92 | 3.19,34.29 5.1,32.38 13.97,32.38 | 13.97,32.38 15.88,32.38 | 15.88,32.38 18.41,29.84 | 18.41,29.84 20.32,27.94 20.32,22.23 25.4,17.14 27.3,17.14 | 27.3,17.14 29.16,15.29 29.16,16.64 | 15.88,32.38 16.51,33.02 16.51,34.92 | 16.51,34.92 16.51,37.47 27.51,48.46 27.51,56.52 29.41,58.42 K2.P | 16.51,34.92 18.41,33.02 18.41,29.84 | 16.51,34.92 13.97,32.38 | 27.3,17.14 C19.1 29.16,16.64 | 29.16,16.64 29.41,16.38 29.41,8.26
PRI-1  (via drill 1 pad 1.27)
  Top 1.27: Q7.D 128.91,44.07 128.91,50.16 127.64,51.44 116.2,51.44 | 116.2,51.44 106.05,51.44 103.76,49.15 Q3.D 103.76,45.34 | 116.2,51.44 Q5.D 116.2,45.21 | HS3.2 116.84,59.03 | 116.84,59.03 HS3.1 | 116.84,59.03 116.2,58.4 116.2,51.44 | Q7.D 128.78,45.21 127,46.99 | Q7.D 128.78,45.09 130.68,46.99 | 116.2,45.21 118.36,47.37 | 116.2,45.21 113.79,47.62 | 103.76,45.34 106.05,47.62 | 103.76,45.34 101.98,47.12
  Bottom 1.27: Q5.D 116.2,37.47 114.3,35.56 R60.2 D13.C | R24.1 113.03,126.36 111.51,124.84 Q4.S 111.51,112.78 | D12.A 92.08,126.36 91.12,125.41 91.12,119.06 | 109.86,111.12 100.33,111.12 98.93,112.52 Q2.S 90.17,116.84 90.17,118.11 91.12,119.06 | 109.86,111.12 110.81,112.08 | 110.81,112.08 111.51,112.78 | Q6.S 123.95,112.39 123.83,112.39 122.56,111.12 113.67,111.12 | 113.67,111.12 113.03,111.76 | 113.03,111.76 112.01,112.78 111.51,112.78 | 109.86,111.12 113.67,111.12 | 110.81,112.08 111.44,112.08 111.76,111.76 113.03,111.76 | 91.12,119.06 92.08,118.11 92.71,118.11
  other vias: 103.5,93.98 106.05,93.98 108.58,93.98 111.12,93.98 113.67,93.98 116.2,93.98 118.75,93.98 121.28,93.98 123.83,93.98 125.09,92.08 122.56,92.08 120.02,92.08 117.47,92.08 114.94,92.08 112.39,92.08 109.86,92.08 107.31,92.08 104.78,92.08 103.5,90.17 106.05,90.17 108.58,90.17 111.12,90.17 113.67,90.17 116.2,90.17 118.75,90.17 121.28,90.17 123.83,90.17 125.09,88.27 122.56,88.27 120.02,88.27 117.47,88.27 114.94,88.27 112.39,88.27 109.86,88.27 107.31,88.27 104.78,88.27 103.5,86.36 106.05,86.36 108.58,86.36 111.12,86.36 113.67,86.36 116.2,86.36 118.75,86.36 121.28,86.36 123.83,86.36 125.09,84.45 122.56,84.45 120.02,84.45 117.47,84.45 114.94,84.45 112.39,84.45 109.86,84.45 107.31,84.45 104.78,84.45 103.5,82.55 106.05,82.55 108.58,82.55 111.12,82.55 113.67,82.55 116.2,82.55 118.75,82.55 121.28,82.55 123.83,82.55 125.09,80.64 123.83,78.74 125.09,76.83 125.09,73.03 123.83,74.93 122.56,73.03 121.28,74.93 122.56,76.83 120.02,76.83 118.75,78.74 120.02,80.64 117.47,80.64 122.56,80.64 114.94,80.64 103.5,78.74 103.5,74.93 104.78,76.83 104.78,80.64 106.05,78.74 107.31,80.64 108.58,78.74 107.31,76.83 106.05,74.93 104.78,73.03 107.31,73.03 109.86,73.03 112.39,73.03 108.58,74.93 109.86,76.83 111.12,78.74 109.86,80.64 112.39,80.64 116.2,78.74 113.67,78.74 114.94,76.83 117.47,76.83 112.39,76.83 111.12,74.93 113.67,74.93 116.2,74.93 114.94,73.03 117.47,73.03 118.75,74.93 120.02,73.03 121.28,78.74
  pour Top (no thermals): 93.34,63.5 139.06,63.5 139.06,46.35 93.34,46.35
  pour Top (isolate 0.813, no thermals): 93.34,63.5 93.34,71.75 102.23,71.75 102.23,94.61 102.87,95.25 125.73,95.25 126.36,94.61 126.36,71.12 139.06,71.12 139.06,63.5
  pour Bottom (isolate 0.813, no thermals): 89.53,118.75 99.69,118.75 99.69,114.94 100.33,114.3 105.41,114.3 106.05,114.94 106.05,118.75 112.39,118.75 112.39,114.94 113.03,114.3 118.11,114.3 118.75,114.94 118.75,118.75 124.46,118.75 124.46,115.57 125.73,114.3 132.72,114.3 132.72,97.16 128.91,97.16 126.36,94.61 126.36,71.12 102.23,71.12 102.23,94.61 99.69,97.16 89.53,97.16
  pour Bottom (isolate 0.813, no thermals): 89.53,118.75 99.69,118.75 99.69,114.94 100.33,114.3 105.41,114.3 106.05,114.94 106.05,118.75 112.39,118.75 112.39,114.94 113.03,114.3 118.11,114.3 118.75,114.94 118.75,118.75 124.46,118.75 124.46,115.57 125.73,114.3 132.72,114.3 132.72,97.16 128.91,97.16 126.36,94.61 126.36,71.12 102.23,71.12 102.23,94.61 99.69,97.16 89.53,97.16
  pour Bottom (isolate 0.813, no thermals): 89.53,118.75 99.69,118.75 99.69,114.94 100.33,114.3 105.41,114.3 106.05,114.94 106.05,118.75 112.39,118.75 112.39,114.94 113.03,114.3 118.11,114.3 118.75,114.94 118.75,118.75 124.46,118.75 124.46,115.57 125.73,114.3 132.72,114.3 132.72,97.16 128.91,97.16 126.36,94.61 126.36,71.12 102.23,71.12 102.23,94.61 99.69,97.16 89.53,97.16
PRI-2  (via drill 1 pad 1.27)
  Top 1.016: D15.C 194.31,34.92 192.41,36.83 191.13,36.83 185.93,42.04 Q9.D
  Top 1.27: 173.35,52.07 162.56,52.07 160.91,50.42 Q13.D 160.91,45.34 | 173.35,52.07 184.15,52.07 186.06,50.16 186.06,44.07 Q9.D 185.93,45.21 | Q11.D 173.35,52.07 | HS2.2 173.35,59.05 | 173.35,59.05 HS2.1 | 173.35,52.07 173.35,59.05 | Q11.D R61.1 | 160.91,45.34 159.26,46.99 | 160.91,45.34 163.19,47.62 | Q11.D 173.35,45.09 171.45,46.99 | Q11.D 173.35,45.21 175.13,46.99 | 185.93,45.21 184.15,46.99 | 185.93,45.21 187.71,46.99
  Bottom 1.27: R54.1 163.83,126.36 156.59,119.13 Q10.S 156.59,112.65 | D17.A 182.25,123.19 182.25,112.39 169.54,112.39 169.04,112.9 | 169.04,112.9 Q8.S | 169.04,112.9 169.04,112.52 167,110.49 158.75,110.49 | Q12.S 144.02,111.89 145.41,110.49 154.43,110.49 | 154.43,110.49 155.32,111.38 | 155.32,111.38 156.59,112.65 | 156.59,112.65 157.8,111.44 | 157.8,111.44 158.75,110.49 | 154.43,110.49 158.75,110.49 | 155.32,111.38 156.59,111.38 156.84,111.12 157.48,111.12 157.8,111.44
  other vias: 155.57,93.98 158.12,93.98 160.66,93.98 163.19,93.98 165.74,93.98 168.28,93.98 170.81,93.98 173.35,93.98 156.84,92.08 159.38,92.08 161.93,92.08 164.47,92.08 167,92.08 169.54,92.08 172.09,92.08 174.62,92.08 155.57,90.17 158.12,90.17 160.66,90.17 163.19,90.17 165.74,90.17 168.28,90.17 170.81,90.17 173.35,90.17 156.84,88.27 159.38,88.27 161.93,88.27 164.47,88.27 167,88.27 169.54,88.27 172.09,88.27 174.62,88.27 155.57,86.36 158.12,86.36 160.66,86.36 163.19,86.36 165.74,86.36 168.28,86.36 170.81,86.36 173.35,86.36 156.84,84.45 159.38,84.45 161.93,84.45 164.47,84.45 167,84.45 169.54,84.45 172.09,84.45 174.62,84.45 155.57,82.55 158.12,82.55 160.66,82.55 163.19,82.55 165.74,82.55 168.28,82.55 170.81,82.55 173.35,82.55 156.84,80.64 159.38,80.64 161.93,80.64 164.47,80.64 167,80.64 169.54,80.64 172.09,80.64 174.62,80.64 155.57,78.74 158.12,78.74 160.66,78.74 163.19,78.74 165.74,78.74 168.28,78.74 170.81,78.74 173.35,78.74 156.84,76.83 159.38,76.83 161.93,76.83 164.47,76.83 167,76.83 169.54,76.83 172.09,76.83 174.62,76.83 155.57,74.93 158.12,74.93 160.66,74.93 163.19,74.93 165.74,74.93 168.28,74.93 170.81,74.93 173.35,74.93 156.84,73.03 159.38,73.03 161.93,73.03 164.47,73.03 167,73.03 169.54,73.03 172.09,73.03 174.62,73.03
  pour Top (no thermals): 150.5,63.5 196.22,63.5 196.22,46.35 150.5,46.35
  pour Bottom (isolate 0.813, no thermals): 140.97,99.06 140.97,118.75 144.78,118.75 144.78,114.3 150.5,114.3 151.13,114.94 151.13,118.75 157.48,118.75 157.48,114.94 158.12,114.3 163.83,114.3 163.83,118.75 169.54,118.75 169.54,115.57 170.81,114.3 184.15,114.3 184.15,98.42 181.61,95.25 175.9,95.25 175.9,71.12 154.31,71.12 154.31,95.25 153.03,96.52 143.51,96.52
  pour Top (isolate 0.813, no thermals): 150.5,63.5 153.03,66.04 153.03,71.12 154.31,71.12 154.31,95.25 175.9,95.25 175.9,71.12 193.68,71.12 193.68,63.5
SW
  Top 0.813: R9.2 31.11,102.87 34.29,99.69 40.01,99.69 41.27,100.97 41.27,103.5 44.45,106.68 50.16,106.68 51.44,105.41 A1.16
  Bottom 1.016: R8.1 R9.2
T_SENS
  Top 0.508: C5.1 46.35,95.25 45.09,96.52 41.27,96.52
  Top 0.813: R5.1 10.16,100.97 11.43,99.69 29.84,99.69 33.02,96.52 41.27,96.52
  Bottom 0.508: C5.1 47.62,93.34 A1.20
  Bottom 1.016: R1.2 R5.1
TX-140
  Top 1.27: TX.2 17.78,58.42 21.21,61.85 K2.S
TX-230
  Top 1.27: TX.3 7.7,53.34 15.88,53.34 17.14,52.07 20.85,52.07 K2.O
V_RS
  Top 1.016: R41.2 62.87,112.39 64.14,111.12 70.48,111.12 74.93,115.57 74.93,121.28 76.2,122.56 R56.2
  Bottom 1.016: 87,133.35 85.72,132.08 85.72,126.36 81.92,122.56 R56.2
  Bottom 1.27: R39.P$2 193.68,93.98 187.32,100.33 187.32,127 180.97,133.35 87,133.35
  pour Bottom (isolate 0.813, no thermals): 186.06,80.64 186.06,101.6 206.38,101.6 206.38,80.64
  pour Top (isolate 0.813, no thermals): 187.96,80.64 187.96,101.6 206.38,101.6 206.38,80.64
VCC
  Top 1.27: R11.1 104.78,19.68 108.58,15.88 R12.1
  Bottom 1.016: 116.84,24.77 124.46,24.77 125.41,25.72 128.59,25.72 129.54,26.67 IC2.3 | K2.1 34.92,52.43 39.09,52.43 42.55,55.88 D14.C | IC1.1 22.23,123.83 25.08,126.68 25.08,132.65 26.42,133.99 59.05,133.99 61.59,131.44 | 61.59,131.44 61.59,130.18 | 61.59,130.18 61.59,128.91 | 61.59,128.91 IC4.8 | C23.1 62.87,130.18 | 62.87,130.18 61.59,130.18 | 62.87,130.18 61.59,131.44 | 62.87,130.18 61.59,128.91 | 20.32,117.47 20.95,117.47 22.23,118.75
  Bottom 1.27: 116.84,24.77 114.3,22.23 R11.1 104.78,21.59 103.5,20.32 95.25,20.32 92.71,22.86 43.81,22.86 36.83,29.84 36.83,36.2 35.54,37.48 34.88,37.48 | C10.1 IC2.3 | R12.1 151.76,15.88 154.31,18.41 154.31,22.86 156.21,24.77 167,24.77 168.28,26.04 IC3.3 C11.1 | 34.88,37.48 33.66,37.48 | 33.66,37.48 32.38,37.48 | 32.38,37.48 K1.4 | 33.66,38.73 D6.C 33.4,45.97 33.4,50.8 | 33.66,38.73 33.66,37.48 | K2.1 33.4,50.8 | D14.C 43.81,60.96 46.99,64.14 46.99,67.94 45.09,69.85 41.91,69.85 40.64,71.12 40.64,73.03 37.78,75.88 30.8,75.88 28.57,78.11 28.57,85.72 25.4,88.9 25.4,97.16 22.86,99.69 22.86,111.76 22.23,112.39 19.68,112.39 | 18.41,115.57 C9.+ 19.05,117.47 | 18.41,115.57 18.41,113.67 | 18.41,113.67 D7.C 19.68,112.39 | 19.05,117.47 20.32,117.47 | 20.32,117.47 C6.1 22.23,118.75 IC1.1 | 19.05,117.47 18.41,116.84 18.41,115.57 | 18.41,115.57 20.32,117.47 | 18.41,113.67 19.68,112.39 | 33.66,38.73 33.63,38.73 | 33.63,38.73 32.38,37.48 | 33.63,38.73 34.88,37.48 | 33.4,50.8 34.92,52.32 34.92,52.43
VO_FEEDBACK
  Top 0.508: R3.2 55.24,60.33 52.07,60.33 50.8,61.59 50.8,64.77 52.07,66.04 53.98,66.04 54.61,66.67 54.61,95.25 53.98,95.89 A1.19
  Bottom 0.508: A1.19 48.9,95.89 C1.1
  Bottom 0.813: R6.1 55.88,53.98 | R3.2 55.88,53.98 | 55.88,53.98
  Bottom 1.016: C4.+ 55.24,52.7 55.88,53.34 R6.1

## Text on the board
tPlace: +5 G | FAN- | FAN+ | SAYANTAN_16-05-2021 | LED- | SW | SW/LED+ | 1mΩ | LM35 | +5 G VO | R39 | LCD | SCL SDA +5 G | TX | ! | 230 140 0 | F1 | ATO-FUSE-HLDR | 12 | 0 | 12 | L N | N L | 230 | 0 | EH_PSWI_50_V.3.0